# Altium schematic sheet 小板.SchDoc
size A4
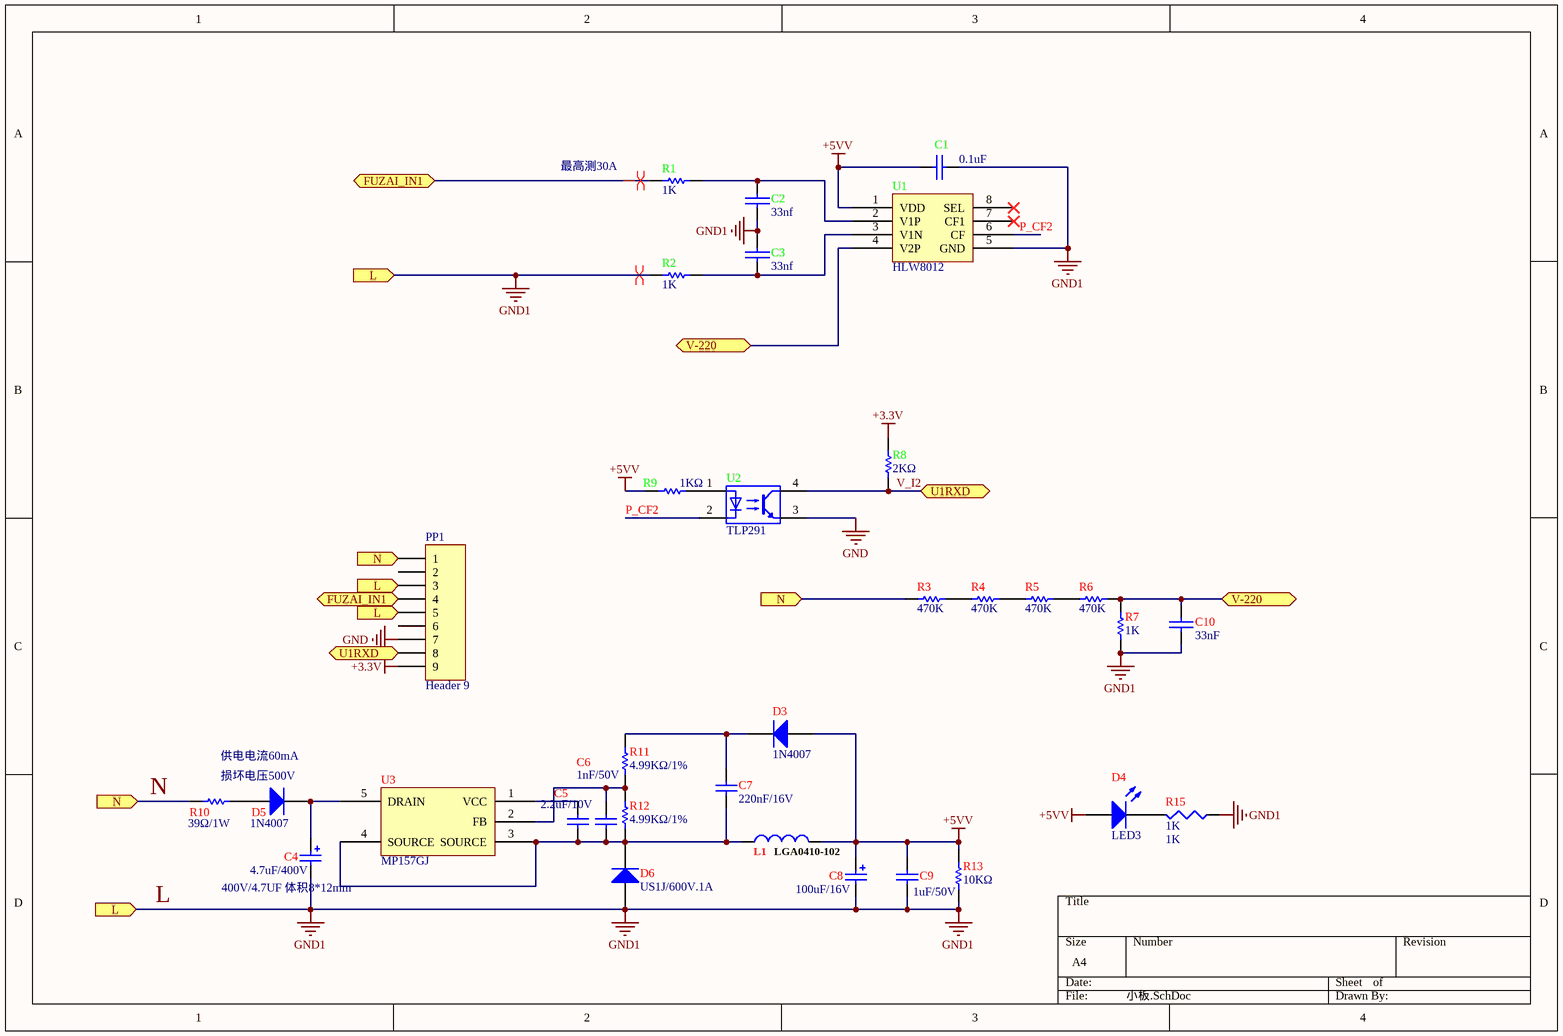
[diagram p0: 小板.SchDoc]

## Parts
C1  0.1uF  [C0603]
C2  33nf  [C0603]
C3  33nf  [C0603]
C4  400V/4.7UF 体积8*12mm  value 4.7uF/400V  [4.7/400]
C5  2.2uF/10V  [C0603]
C6  1nF/50V  [C0603]
C7  220nF/16V  [C0603]
C8  100uF/16V  [RB.1/.2]
C9  1uF/50V  [C0603]
C10  33nF  [C0603]
D3  1N4007  [DO-214]
D4  LED3  [L-0805]
D5  1N4007  [DO-214]
D6  US1J/600V.1A  [DO-214]
L1  LGA0410-102  [L-8*10]
PP1  Header 9  [HDR1X9]
R1  1K  [3-0603]
R2  1K  [3-0603]
R3  470K  [3-0603]
R4  470K  [3-0603]
R5  470K  [3-0603]
R6  470K  [3-0603]
R7  1K  [3-0603]
R8  2KΩ  [3-0603]
R9  1KΩ  [3-0603]
R10  39Ω/1W  [AXIAL0.6]
R11  4.99KΩ/1%  [3-0603]
R12  4.99KΩ/1%  [3-0603]
R13  10KΩ  [3-0603]
R15  1K  [3-0603]
U1  HLW8012  [SOP8]
U2  TLP291  [PS2811-SOP4]
U3  MP157GJ  [SOT-23-5]

## Ports
FUZAI_IN1, L, N, U1RXD, V-220

## Nets
+3.3V: PP1.9 R8.2
+5VV: C1.1 C8.1 C9.1 D3.1 D4.1(A) L1.2 R9.1 R13.2 U1.1(VDD)
GND: PP1.7 U2.3
L: C1.2 C2.2 C3.1 C4.2 C8.2 C9.2 C10.1 D6.1 PP1.3 PP1.5 R2.2 R7.1 R13.1 R15.1 U1.5(GND) ; port L  [also labelled GND1]
FUZAI_IN1: PP1.4 R1.2 ; port FUZAI_IN1
N: PP1.1 R3.1 R10.1 ; port N
P_CF2: U1.6(CF) U2.2
V-220: C10.2 R6.2 R7.2 U1.4(V2P) ; port V-220
V_I2: PP1.8 R8.1 U2.4 ; port U1RXD
NetC2_1: C2.1 R1.1 U1.2(V1P)
NetC3_2: C3.2 R2.1 U1.3(V1N)
NetC4_1: C4.1 D5.2 U3.5(DRAIN)
NetC5_1: C5.1 U3.1(VCC)
NetC5_2: C5.2 C6.2 C7.2 D6.2 L1.1 R12.2 U3.3(SOURCE) U3.4(SOURCE)
NetC6_1: C6.1 R11.1 R12.1 U3.2(FB)
NetC7_1: C7.1 D3.2 R11.2
NetD4_2: D4.2(K) R15.2
NetD5_1: D5.1 R10.2
NetR3_2: R3.2 R4.1
NetR4_2: R4.2 R5.1
NetR5_2: R5.2 R6.1
NetR9_2: R9.2 U2.1

Not connected (* = marked no-connect by the designer): PP1 2 6; U1 7(CF1)* 8(SEL)*

## Layout directives
differential pair: FUZAI_IN1, L

## Notes on the sheet
- 最高测30A
- 供电电流60mA
- 损坏电压500V

## Library data of the parts
C1-C3 = CAP: Capacitor
C4 C8 = Cap Pol2: 插件电解电容; Published: 8-Jun-2000; LatestRevisionDate: 17-Jul-2002; LatestRevisionNote: Re-released for DXP Platform.; PackageReference: POLAR0.8; Publisher: Altium Limited
  C8: Value: 100uF/16V
C5-C7 C9 = Cap: 贴片电容; Published: 8-Jun-2000; LatestRevisionDate: 17-Jul-2002; LatestRevisionNote: Re-released for DXP Platform.; Publisher: Altium Limited
C10 = 贴片电容
D3 D5 D6 = 二极管: 贴片二极管; Manufacturer: Generic Components; Class: Discrete; SubClass: Diode - Switching; Published: 08/06/2000; Publisher: Altium Hobart Technology Centre
D4 = LED3: 红色贴片二极管; Published: 8-Jun-2000; LatestRevisionDate: 17-Dec-2003; LatestRevisionNote: PCB Footprint replaced.; DatasheetVersion: 16-Apr-2002; PackageVersion: 16-Apr-2002; PackageReference: 3.5X2.8X1.9; Publisher: Altium Limited; PackageDescription: SM LED; 2 C-Bend Leads; Body 3.5 x 2.8 x 1.9 mm, inc leads (LxWxH typ)
L1 = INDUCTOR: Value: 1mH
PP1 = Header 9: Header, 9-Pin; LatestRevisionDate: 17-Jul-2002; LatestRevisionNote: Re-released for DXP Platform.; Publisher: Altium Limited
R1 R2 R8 R9 = Res1: Resistor; Published: 8-Jun-2000; LatestRevisionDate: 17-Jul-2002; LatestRevisionNote: Re-released for DXP Platform.; Publisher: Altium Limited
R3-R7 R11-R13 = Res1: 贴片电阻; Published: 8-Jun-2000; LatestRevisionDate: 17-Jul-2002; LatestRevisionNote: Re-released for DXP Platform.; Publisher: Altium Limited
R10 = Res1: 直插电阻; Published: 8-Jun-2000; LatestRevisionDate: 17-Jul-2002; LatestRevisionNote: Re-released for DXP Platform.; Publisher: Altium Limited
R15 = Res3: 贴片电阻; Published: 8-Jun-2000; LatestRevisionDate: 29-May-2009; LatestRevisionNote: IPC-7351 Footprint Added.; PackageReference: J1-0603; Publisher: Altium Limited; PackageDescription: Chip Resistor; Value: 1K
U2 = TLP521-1: TLP28-2P
U3 = MP150: 电源芯片